# Altium schematic sheet 48V-5V Buck.SchDoc: 48-5V Buck
size Letter; DrawnBy: Melissa Jacobs; Organization: UW Robotics; Address1: 200 University Avenue; Address2: Waterloo; Address3: Canada; Address4: Canada N2L 3G6; Revision: 1; SheetNumber: 1; SheetTotal: 1
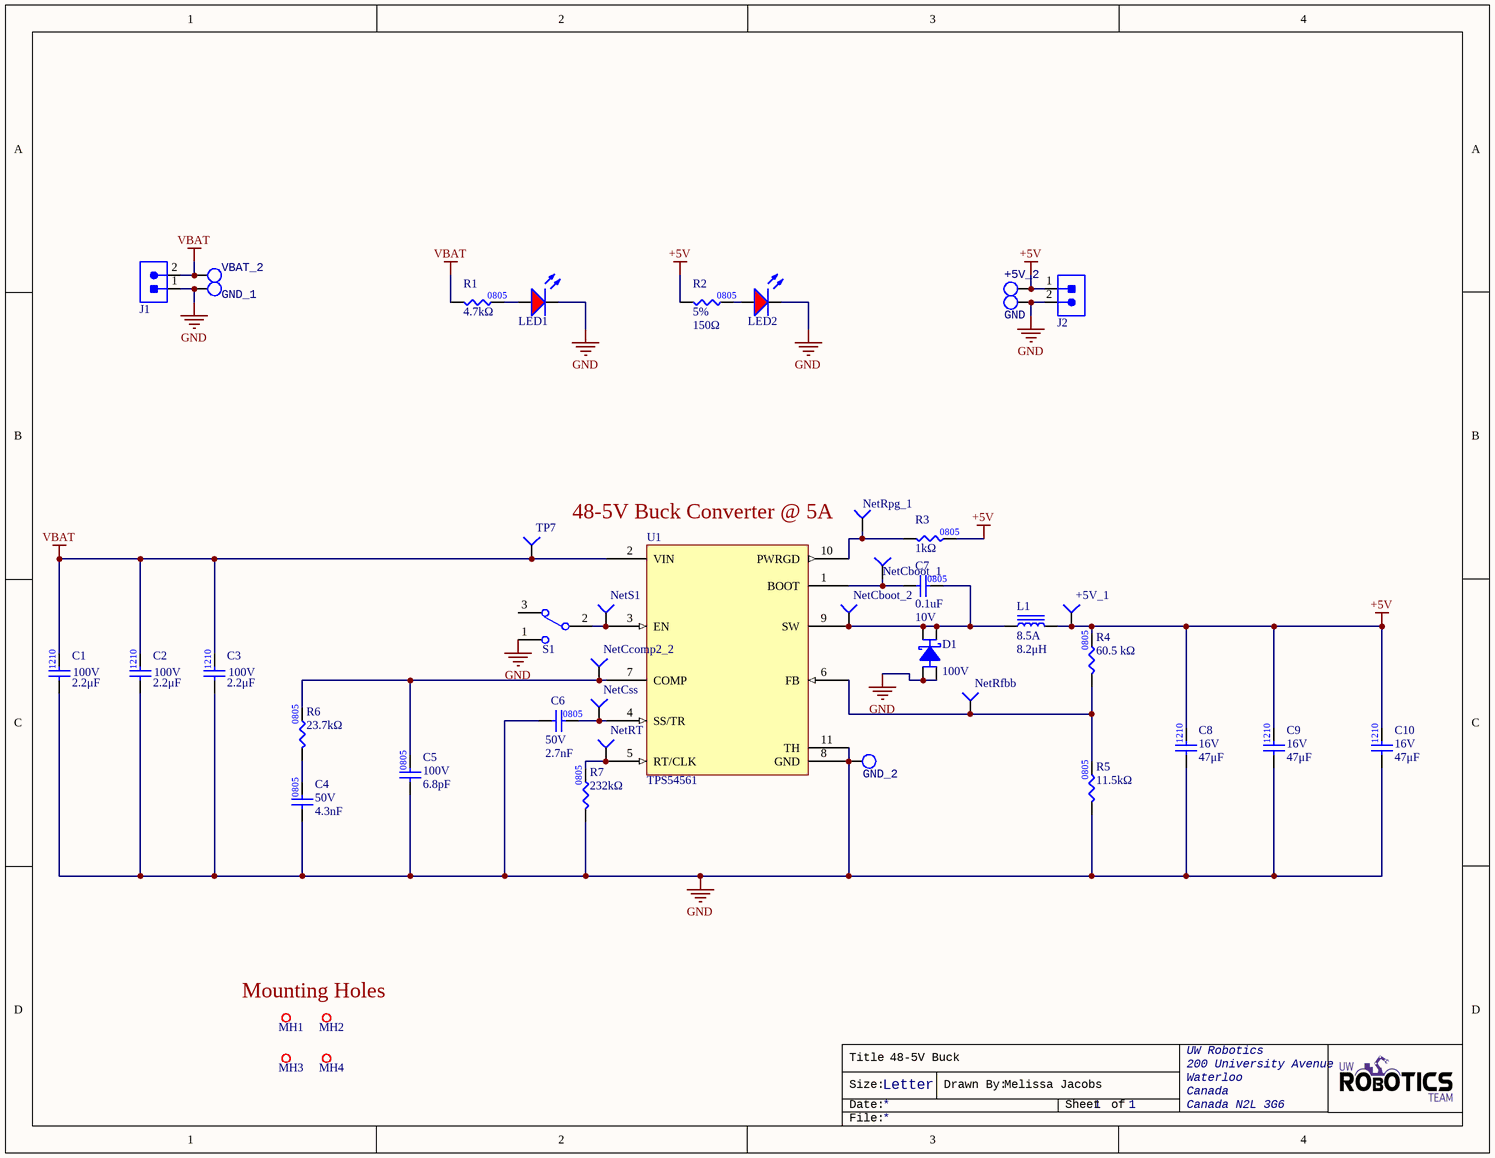
[diagram p0: 48V-5V Buck.SchDoc]

## Parts
+5V_1  TESTPOINT_1MM_CIRCLE  [TESTPOINT_CIRCLE_1MM]  (value not drawn)  (no BOM)
+5V_2  TESTPOINT_LOOP  [TESTPOINT_LOOP]  (value not drawn)
C1  value 2.2μF  Voltage Rating: 100V  [CAPC3225X270N]  (hidden comment: CAP_2.2uF_100V_1210_1)
C2  value 2.2μF  Voltage Rating: 100V  [CAPC3225X270N]  (hidden comment: CAP_2.2uF_100V_1210_1)
C3  value 2.2μF  Voltage Rating: 100V  [CAPC3225X270N]  (hidden comment: CAP_2.2uF_100V_1210_1)
C4  value 4.3nF  Voltage Rating: 50V  [CAP2012]  (hidden comment: CAP_4.3nF_50V_0805)
C5  value 6.8pF  Voltage Rating: 100V  [CAP2012]  (hidden comment: CAP_6.8pF_100V_0805_0.1pF)
C6  value 2.7nF  Voltage Rating: 50V  [CAP0805]  (hidden comment: CAP_2.7nF_50V_0805)
C7  value 0.1uF  Voltage Rating: 10V  [CAP0805]  (hidden comment: CAP_0.1uF_10V_0805)
C8  value 47μF  Voltage Rating: 16V  [CAPC3225X270N]  (hidden comment: CAP_47uF_16V_1210)
C9  value 47μF  Voltage Rating: 16V  [CAPC3225X270N]  (hidden comment: CAP_47uF_16V_1210)
C10  value 47μF  Voltage Rating: 16V  [CAPC3225X270N]  (hidden comment: CAP_47uF_16V_1210)
D1  Vr (Max): 100V  [D-PAK]  (hidden comment: DIO_SCHOTTKY_100V_5.5A)
GND  TESTPOINT_LOOP  [TESTPOINT_LOOP]  (value not drawn)
GND_1  TESTPOINT_LOOP  [TESTPOINT_LOOP]  (value not drawn)
GND_2  TESTPOINT_LOOP  [TESTPOINT_LOOP]  (value not drawn)
J1  CON_2POS_SCREW_TERM  [1935161]  (value not drawn)
J2  CON_2POS_SCREW_TERM  [1935161]  (value not drawn)
L1  value 8.2μH  Current Rating: 8.5A  [IND_8.2uH_8.5A]  (hidden comment: IND_8.2uH_8.5A)
LED1  LED_RED  [LED_0805_RED]  (value not drawn)
LED2  LED_RED  [LED_0805_RED]  (value not drawn)
MH1  MOUNTING_HOLE_M3_GIMBAL_REV2  [MOUNTING_HOLE_3mm_GIMBAL_REV2]  (value not drawn)  (no BOM)
MH2  MOUNTING_HOLE_M3_GIMBAL_REV2  [MOUNTING_HOLE_3mm_GIMBAL_REV2]  (value not drawn)  (no BOM)
MH3  MOUNTING_HOLE_M3_GIMBAL_REV2  [MOUNTING_HOLE_3mm_GIMBAL_REV2]  (value not drawn)  (no BOM)
MH4  MOUNTING_HOLE_M3_GIMBAL_REV2  [MOUNTING_HOLE_3mm_GIMBAL_REV2]  (value not drawn)  (no BOM)
NetCboot_1  TESTPOINT_1MM_CIRCLE  [TESTPOINT_CIRCLE_1MM]  (value not drawn)  (no BOM)
NetCboot_2  TESTPOINT_1MM_CIRCLE  [TESTPOINT_CIRCLE_1MM]  (value not drawn)  (no BOM)
NetCcomp2_2  TESTPOINT_1MM_CIRCLE  [TESTPOINT_CIRCLE_1MM]  (value not drawn)  (no BOM)
NetCss  TESTPOINT_1MM_CIRCLE  [TESTPOINT_CIRCLE_1MM]  (value not drawn)  (no BOM)
NetRfbb  TESTPOINT_1MM_CIRCLE  [TESTPOINT_CIRCLE_1MM]  (value not drawn)  (no BOM)
NetRpg_1  TESTPOINT_1MM_CIRCLE  [TESTPOINT_CIRCLE_1MM]  (value not drawn)  (no BOM)
NetRT  TESTPOINT_1MM_CIRCLE  [TESTPOINT_CIRCLE_1MM]  (value not drawn)  (no BOM)
NetS1  TESTPOINT_1MM_CIRCLE  [TESTPOINT_CIRCLE_1MM]  (value not drawn)  (no BOM)
R1  value 4.7kΩ  [RES0805]  (hidden comment: RES_4.7kΩ_0805_5%)
R2  value 150Ω  Tolerance: 5%  [RES0805]  (hidden comment: RES_150Ω_0805_5%)
R3  value 1kΩ  [RES0805]  (hidden comment: RES_1kΩ_0805_1%)
R4  value 60.5 kΩ  [RES0805]  (hidden comment: RES_60.4kΩ_0805_1%)
R5  value 11.5kΩ  [RES0805]  (hidden comment: RES_11.5kΩ_0805_0.1%)
R6  value 23.7kΩ  [RES0805]  (hidden comment: RES_23.7kΩ_0805_1%)
R7  value 232kΩ  [RES0805]  (hidden comment: RES_232kΩ_0805_1%)
S1  SW_SLIDE_TOGGLE  [SW_SLIDE_TOGGLE]  (value not drawn)
TP7  TESTPOINT_1MM_CIRCLE  [TESTPOINT_CIRCLE_1MM]  (value not drawn)  (no BOM)
U1  TPS54561  [BUCK_TPS54561DPRR]
VBAT_2  TESTPOINT_LOOP  [TESTPOINT_LOOP]  (value not drawn)

## Nets
+5V: +5V_1.1(=value) +5V_2.1 C8.2 C9.2 C10.2 J2.1 L1.2 R2.1 R3.2 R4.2
GND: C1.1 C2.1 C3.1 C4.1 C5.1 C6.1 C8.1 C9.1 C10.1 D1.1(Anode) D1.3 GND.1 GND_1.1 GND_2.1 J1.1 J2.2 LED1.2(K) LED2.2(K) R5.1 R7.1 S1.1 U1.8(GND) U1.11(TH)
VBAT: C1.2 C2.2 C3.2 J1.2 R1.1 TP7.1(=value) U1.2(VIN) VBAT_2.1
NetC4_2: C4.2 R6.1
NetC5_2: C5.2 NetCcomp2_2.1(=value) R6.2 U1.7(COMP)
NetC6_2: C6.2 NetCss.1(=value) U1.4(SS/TR)
NetC7_1: C7.1 NetCboot_1.1(=value) U1.1(BOOT)
NetC7_2: C7.2 D1.2(Cathode) D1.4 L1.1 NetCboot_2.1(=value) U1.9(SW)
NetLED1_1: LED1.1(A) R1.2
NetLED2_1: LED2.1(A) R2.2
NetNetRfbb_1: NetRfbb.1(=value) R4.1 R5.2 U1.6(FB)
NetNetRpg_1_1: NetRpg_1.1(=value) R3.1 U1.10(PWRGD)
NetNetRT_1: NetRT.1(=value) R7.2 U1.5(RT/CLK)
NetNetS1_1: NetS1.1(=value) S1.2 U1.3(EN)

Not connected (* = marked no-connect by the designer): S1 3

## Notes on the sheet
- (near NetRpg_1) 48-5V Buck Converter @ 5A
- Mounting Holes
- Title
- Size:
- Date:
- Letter
- Drawn By:
- Sheet
- of
- File:
- (in symbol RES_150Ω_0805_5%) 0805

## Library data of the parts
+5V_1 NetCboot_1 NetCboot_2 NetCcomp2_2 NetCss NetRfbb NetRpg_1 NetRT NetS1 TP7 = TESTPOINT_1MM_CIRCLE: TESTPOINT 1MM CIRCLE
+5V_2 GND GND_1 GND_2 VBAT_2 = TESTPOINT_LOOP: TESTPOINT THRUHOLE; Manufacturer 1: Keystone Electronics; Manufacturer Part Number 1: 5002; Package/Footprint: TH; Supplier Part Number 1: 36-5002-ND; Supplier 1: Digi-Key; Mounting Type: TH
C1-C3 = CAP_2.2uF_100V_1210_1: CAP CER 2.2UF 100V X7R 1210; Manufacturer 1: TDK Corporation; Manufacturer Part Number 1: C3225X7R2A225K230AB; Package/Footprint: 1210; Supplier 1: Digi-Key; Supplier Part Number 1: 445-4497-1-ND; Mounting Type: SMD
C4 = CAP_4.3nF_50V_0805: CAP CER 4.3nF 50V C0G/NP0 0805; Manufacturer Part Number 1: C0805C432J5GAC7800; Manufacturer 1: KEMET; Supplier Part Number 1: 399-15050-6-ND; Supplier 1: Digi-Key; Mounting Type: SMD; Package: 0805
C5 = CAP_6.8pF_100V_0805_0.1pF: CAP CER 6.8pF 100V C0G/NP0 0805; Manufacturer Part Number 1: CBR08C689B1GAC; Manufacturer 1: KEMET; Supplier Part Number 1: 399-8705-6-ND; Supplier 1: Digi-Key; Mounting Type: SMD; Package: 0805
C6 = CAP_2.7nF_50V_0805: CAP CER 2700PF 50V C0G 0805; Manufacturer 1: TDK Corporation; Manufacturer Part Number 1: C2012C0G1H272J060AA; Package/Footprint: 0805; Supplier 1: Digi-Key; Supplier Part Number 1: 445-7508-1-ND
C7 = CAP_0.1uF_10V_0805: CAP CER 0.1uF 10V 0805; Manufacturer 1: KEMET; Manufacturer Part Number 1: C0805C104K8RAC7800; Package/Footprint: 0805; Supplier 1: Digi-Key; Supplier Part Number 1: 399-C0805C104K8RAC7800DKR-ND
C8-C10 = CAP_47uF_16V_1210: CAP CER 47uF 16V X5R 1210; Manufacturer 1: Murata Electronics; Manufacturer Part Number 1: GRM32ER61C476KE15L; Package/Footprint: 1210; Supplier 1: Digi-Key; Supplier Part Number 1: 490-6539-6-ND; Mounting Type: SMD
D1 = DIO_SCHOTTKY_100V_5.5A: DIODE SCHOTTKY 100V 5.5A DPAK; Manufacturer 1: Vishay General Semiconductor - Diodes Division; Manufacturer Part Number 1: VS-50WQ10FN-M3; Package/Footprint: TO-252-3, DPak (2 Leads + Tab), SC-63; Supplier 1: Digi-Key; Supplier Part Number 1: VS-50WQ10FN-M3-ND; Mounting Type: SMD
J1 J2 = CON_2POS_SCREW_TERM: TERM BLK 2POS SIDE ENTRY 5MM; Manufacturer 1: Phoenix Contact; Package/Footprint: SMD; Supplier 1: Digi-Key; Mounting Type: TH; Supplier Part Number 1: 277-1667-ND; Manufacturer Part Number 1: 1935161
L1 = IND_8.2uH_8.5A: FIXED IND 8.2UH 8.5A 28 MOHM SMD; Manufacturer 1: Vishay Dale; Manufacturer Part Number 1: IHLP5050CEER8R2M01; Supplier Part Number 1: 541-2596-6-ND; Supplier 1: Digi-Key; Mounting Type: SMD; Package/Footprint: SMD
LED1 LED2 = LED_RED: LED RED DIFFUSED 0805 SMD; Manufacturer 1: OSRAM; Manufacturer Part Number 1: LS R976-NR-1; Package/Footprint: 0805; Forward Voltage Drop: 2V; Supplier Part Number 1: 475-1278-1-ND; Supplier 1: Digi-Key; Mounting Type: SMD
MH1-MH4 = MOUNTING_HOLE_M3_GIMBAL_REV2: MOUNTING_HOLE_M3 Gimbal Rev2
R1 = RES_4.7kΩ_0805_5%: RES 4.7K OHM 5% 1/8W 0805; Manufacturer 1: Yageo; Manufacturer Part Number 1: RC0805JR-074K7L; Supplier 1: Digi-Key; Supplier Part Number 1: 311-4.7KARCT-ND; Mounting Type: SMD; LCSC Part #: C17673; Package: 0805
R2 = RES_150Ω_0805_5%: RES 150 OHM 5% 1/8W 0805; Manufacturer 1: YAGEO; Manufacturer Part Number 1: RC0805JR-07150RL; Supplier 1: Digi-Key; Supplier Part Number 1: 311-150ARDKR-ND; Mounting Type: SMD
R3 = RES_1kΩ_0805_1%: RES 1K OHM 1% 1/8W 0805; Manufacturer 1: Yageo; Manufacturer Part Number 1: RC0805FR-071K07L; Supplier 1: Digi-Key; Mounting Type: SMD; Supplier Part Number 1: 311-1.07KCRCT-ND; Package: 0805
R4 = RES_60.4kΩ_0805_1%: RES 60.5 kOHM 63 mW 0805; Manufacturer 1: Vishay Dale; Manufacturer Part Number 1: RCS080560K4FKEA; Package/Footprint: 0805; Supplier Part Number 1: 541-RCS080560K4FKEADKR-ND; Supplier 1: Digi-Key; Mounting Type: SMD
R5 = RES_11.5kΩ_0805_0.1%: RES 11.5K OHM 0.1% 1/10W 0805; Manufacturer 1: TE Connectivity Passive Product; Manufacturer Part Number 1: RN73C2A11K5BTDF; Package/Footprint: 0805; Supplier Part Number 1: A103292DKR-ND; Supplier 1: Digi-Key; Mounting Type: SMD
R6 = RES_23.7kΩ_0805_1%: RES 1.07K OHM 1% 1/8W 0805; Manufacturer 1: Yageo; Manufacturer Part Number 1: RC0805FR-0723K7L; Supplier 1: Digi-Key; Mounting Type: SMD; Supplier Part Number 1: 311-23.7KCRDKR-ND; Package: 0805
R7 = RES_232kΩ_0805_1%: RES 232K OHM 1% 1/8W 0805; Manufacturer 1: Vishay Dale; Manufacturer Part Number 1: CRCW0805232RFKEA; Supplier 1: Digi-Key; Supplier Part Number 1: 541-232CDKR-ND; Mounting Type: SMD; LCSC Part #: 0; Package: 0805
S1 = SW_SLIDE_TOGGLE: SWITCH SLIDE SPDT 200MA 30V; Manufacturer 1: E-Switch; Manufacturer Part Number 1: 100SP1T1B4M2QE; Package/Footprint: TH; Supplier 1: Digi-Key; Mounting Type: TH; Voltage Rating (DC): 30V; Throw Configuration: SPDT; Supplier Part Number 1: EG1903-ND
U1 = TPS54561: Buck Switching Regulator IC Positive Adjustable 0.8V 1 Output 5A 10-WDFN Exposed Pad; Manufacturer 1: Texas Instruments; Manufacturer Part Number 1: TPS54561DPRR; Supplier 1: Digi-Key; Supplier Part Number 1: 296-40803-1-ND; Mounting Type: SMD; Package/Footprint: 10-WDFN Exposed Pad